# EAGLE design wheel (EAGLE 9.2.2)

## Sheet 1 of 2
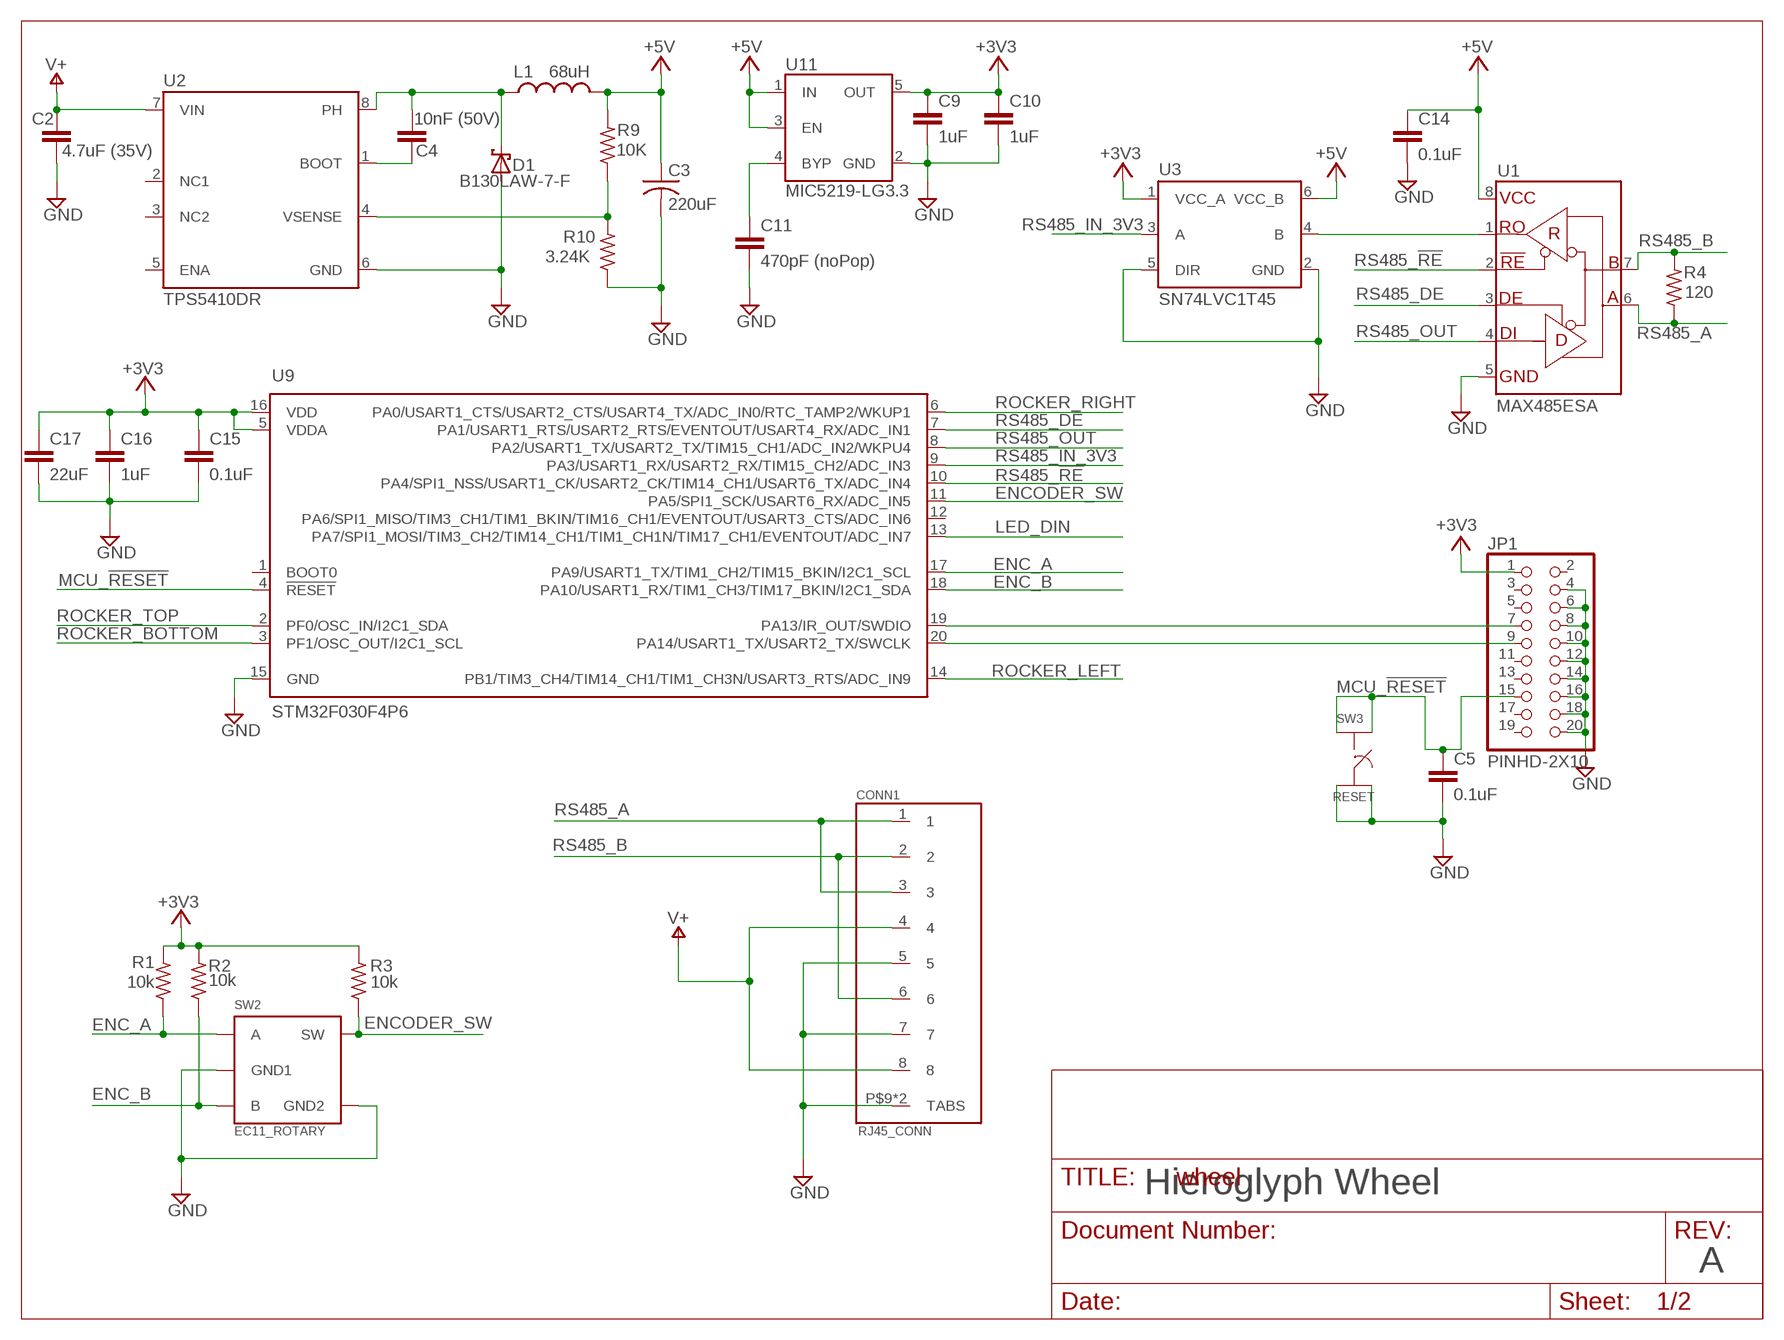
[diagram p0: schematic, sheet 1]

### Parts
C2  4.7uF (35V)  C-EUC0805  [C0805]
C3  220uF  TANT_CAP_D  [KEMET_D_CAP]
C4  10nF (50V)  C-EUC0805  [C0805]
C5  0.1uF  C-EUC0805  [C0805]
C9  1uF  C-EUC0805  [C0805]
C10  1uF  C-EUC0805  [C0805]
C11  470pF (noPop)  C-EUC0805  [C0805]
C14  0.1uF  C-EUC0805  [C0805]
C15  0.1uF  C-EUC0805  [C0805]
C16  1uF  C-EUC0805  [C0805]
C17  22uF  C-EUC0805  [C0805]
CONN1  RJ45_CONN  [RJ45_VERT]
D1  B130LAW-7-F  [SOD123]
JP1  PINHD-2X10  [2X10_W_KEY]
L1  68uH  L_CDRH127  [CDRH127R]
R1  10k  R-US_R0805  [R0805]
R2  10k  R-US_R0805  [R0805]
R3  10k  R-US_R0805  [R0805]
R4  120  R-US_R0805  [R0805]
R9  10K  R-US_R0805  [R0805]
R10  3.24K  R-US_R0805  [R0805]
SW2  EC11_ROTARY  [EC11_ROTARY]
SW3  RESET  MOM_SWITCH  [MOM_SWITCH]
U1  MAX485ESA  [SO08]
U2  TPS5410DR  [SO08]
U3  SN74LVC1T45  [SOT23-6]
U9  STM32F030F4P6  [TSSOP20]
U11  MIC5219-LG3.3  MIC5219XX  [SOT23-5]

### Nets
+3V3: C9.1 C10.1 C15.1 C16.1 C17.1 JP1.1 R1.2 R2.2 R3.2 U3.1(VCC_A) U9.5(VDDA) U9.16(VDD) U11.5(OUT) ; also sheet 2
+5V: C3.+ C14.1 L1.P$2 R9.2 U1.8(VCC) U3.6(VCC_B) U11.1(IN) U11.3(EN) ; also sheet 2
ENC_A: R1.1 SW2.A U9.17(PA9/USART1_TX/TIM1_CH2/TIM15_BKIN/I2C1_SCL)
ENC_B: R2.1 SW2.B U9.18(PA10/USART1_RX/TIM1_CH3/TIM17_BKIN/I2C1_SDA)
ENCODER_SW: R3.1 SW2.SW U9.11(PA5/SPI1_SCK/USART6_RX/ADC_IN5)
GND: C2.2 C3.- C5.2 C9.2 C10.2 C11.2 C14.2 C15.2 C16.2 C17.2 CONN1.5 CONN1.7 CONN1.P$9(TABS) CONN1.P$10(TABS) D1.A JP1.4 JP1.6 JP1.8 JP1.10 JP1.12 JP1.14 JP1.16 JP1.18 JP1.20 R10.1 SW2.C(GND1) SW2.D(GND2) SW3.P$3 SW3.P$4 U1.5(GND) U2.6(GND) U3.2(GND) U3.5(DIR) U9.15(GND) U11.2(GND) ; also sheet 2
LED_DIN: U9.13(PA7/SPI1_MOSI/TIM3_CH2/TIM14_CH1/TIM1_CH1N/TIM17_CH1/EVENTOUT/ADC_IN7) ; also sheet 2
MCU_!RESET: C5.1 JP1.15 SW3.P$1 SW3.P$2 U9.4(!RESET)
N$1: C11.1 U11.4(BYP)
N$2: R9.1 R10.2 U2.4(VSENSE)
N$3: C4.1 D1.C L1.1 U2.8(PH)
N$4: C4.2 U2.1(BOOT)
N$10: JP1.7 U9.19(PA13/IR_OUT/SWDIO)
N$11: JP1.9 U9.20(PA14/USART1_TX/USART2_TX/SWCLK)
N$16: U1.1(RO) U3.4(B)
ROCKER_BOTTOM: U9.3(PF1/OSC_OUT/I2C1_SCL) ; also sheet 2
ROCKER_LEFT: U9.14(PB1/TIM3_CH4/TIM14_CH1/TIM1_CH3N/USART3_RTS/ADC_IN9) ; also sheet 2
ROCKER_RIGHT: U9.6(PA0/USART1_CTS/USART2_CTS/USART4_TX/ADC_IN0/RTC_TAMP2/WKUP1) ; also sheet 2
ROCKER_TOP: U9.2(PF0/OSC_IN/I2C1_SDA) ; also sheet 2
RS485_!RE: U1.2(!RE) U9.10(PA4/SPI1_NSS/USART1_CK/USART2_CK/TIM14_CH1/USART6_TX/ADC_IN4)
RS485_A: CONN1.1 CONN1.3 R4.1 U1.6(A)
RS485_B: CONN1.2 CONN1.6 R4.2 U1.7(B)
RS485_DE: U1.3(DE) U9.7(PA1/USART1_RTS/USART2_RTS/EVENTOUT/USART4_RX/ADC_IN1)
RS485_IN_3V3: U3.3(A) U9.9(PA3/USART1_RX/USART2_RX/TIM15_CH2/ADC_IN3)
RS485_OUT: U1.4(DI) U9.8(PA2/USART1_TX/USART2_TX/TIM15_CH1/ADC_IN2/WKPU4)
V+: C2.1 CONN1.4 CONN1.8 U2.7(VIN)
Unconnected: JP1.2 JP1.3 JP1.5 JP1.11 JP1.13 JP1.17 JP1.19 U2.2(NC1) U2.3(NC2) U2.5(ENA) U9.1(BOOT0) U9.12(PA6/SPI1_MISO/TIM3_CH1/TIM1_BKIN/TIM16_CH1/EVENTOUT/USART3_CTS/ADC_IN6)

### Notes on the sheet
- Hieroglyph Wheel
- A

## Sheet 2 of 2
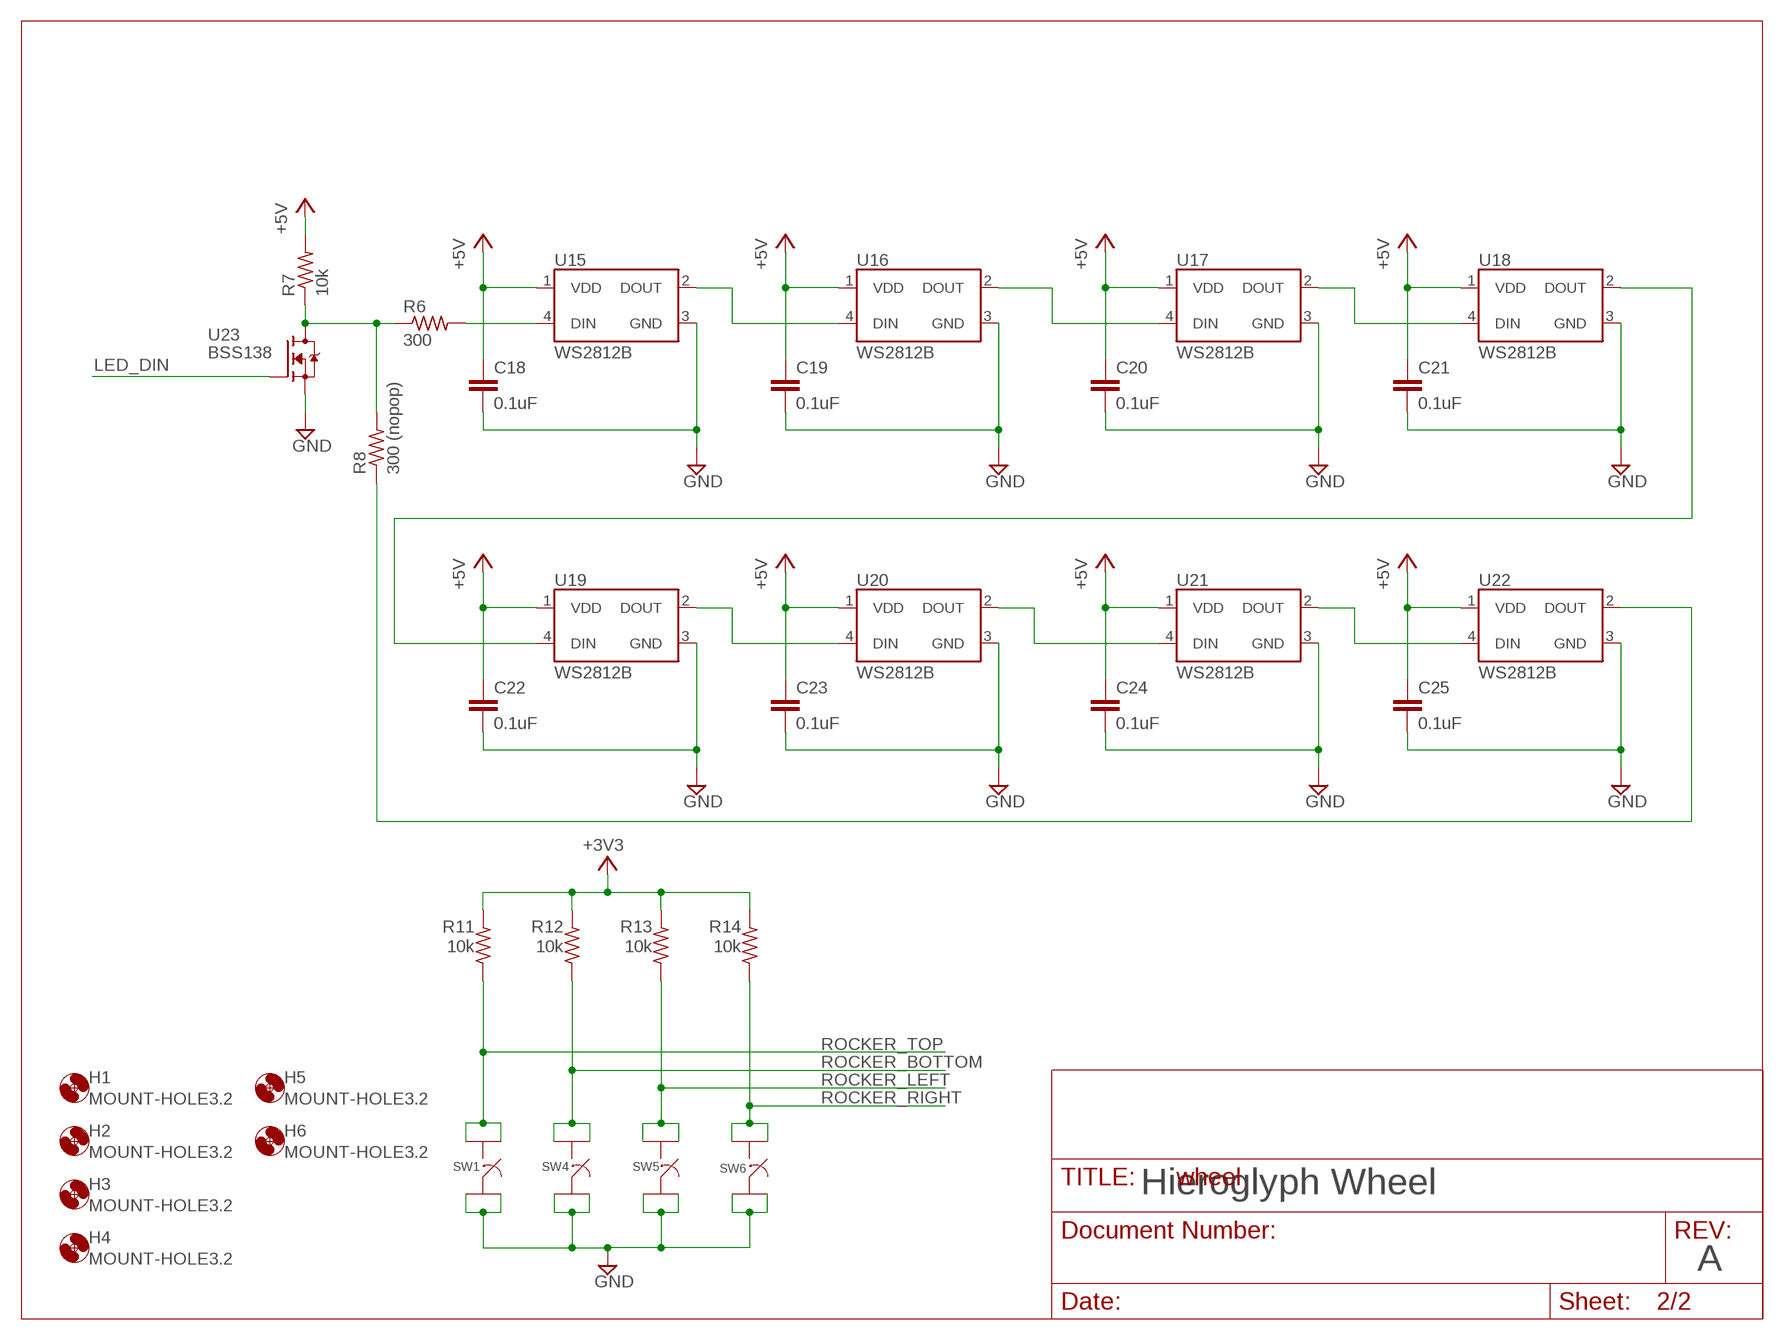
[diagram p1: schematic, sheet 2]

### Parts
C18  0.1uF  C-EUC0805  [C0805]
C19  0.1uF  C-EUC0805  [C0805]
C20  0.1uF  C-EUC0805  [C0805]
C21  0.1uF  C-EUC0805  [C0805]
C22  0.1uF  C-EUC0805  [C0805]
C23  0.1uF  C-EUC0805  [C0805]
C24  0.1uF  C-EUC0805  [C0805]
C25  0.1uF  C-EUC0805  [C0805]
H1  MOUNT-HOLE3.2  [3,2]
H2  MOUNT-HOLE3.2  [3,2]
H3  MOUNT-HOLE3.2  [3,2]
H4  MOUNT-HOLE3.2  [3,2]
H5  MOUNT-HOLE3.2  [3,2]
H6  MOUNT-HOLE3.2  [3,2]
R6  300  R-US_R0805  [R0805]
R7  10k  R-US_R0805  [R0805]
R8  300 (nopop)  R-US_R0805  [R0805]
R11  10k  R-US_R0805  [R0805]
R12  10k  R-US_R0805  [R0805]
R13  10k  R-US_R0805  [R0805]
R14  10k  R-US_R0805  [R0805]
SW1  MOM_SWITCH  [MOM_SWITCH]
SW4  MOM_SWITCH  [MOM_SWITCH]
SW5  MOM_SWITCH  [MOM_SWITCH]
SW6  MOM_SWITCH  [MOM_SWITCH]
U15  WS2812B  [WS2812B]
U16  WS2812B  [WS2812B]
U17  WS2812B  [WS2812B]
U18  WS2812B  [WS2812B]
U19  WS2812B  [WS2812B]
U20  WS2812B  [WS2812B]
U21  WS2812B  [WS2812B]
U22  WS2812B  [WS2812B]
U23  BSS138  [SOT23]

### Nets
+3V3: R11.2 R12.2 R13.2 R14.2 ; also sheet 1
+5V: C18.1 C19.1 C20.1 C21.1 C22.1 C23.1 C24.1 C25.1 R7.2 U15.1(VDD) U16.1(VDD) U17.1(VDD) U18.1(VDD) U19.1(VDD) U20.1(VDD) U21.1(VDD) U22.1(VDD) ; also sheet 1
GND: C18.2 C19.2 C20.2 C21.2 C22.2 C23.2 C24.2 C25.2 SW1.P$3 SW1.P$4 SW4.P$3 SW4.P$4 SW5.P$3 SW5.P$4 SW6.P$3 SW6.P$4 U15.3(GND) U16.3(GND) U17.3(GND) U18.3(GND) U19.3(GND) U20.3(GND) U21.3(GND) U22.3(GND) U23.2(S) ; also sheet 1
LED_DIN: U23.1(G) ; also sheet 1
N$17: U15.2(DOUT) U16.4(DIN)
N$20: U16.2(DOUT) U17.4(DIN)
N$21: U17.2(DOUT) U18.4(DIN)
N$22: U19.2(DOUT) U20.4(DIN)
N$23: U20.2(DOUT) U21.4(DIN)
N$24: U21.2(DOUT) U22.4(DIN)
N$25: U18.2(DOUT) U19.4(DIN)
N$26: R6.2 U15.4(DIN)
N$27: R6.1 R7.1 R8.2 U23.3(D)
N$28: R8.1 U22.2(DOUT)
ROCKER_BOTTOM: R12.1 SW4.P$1 SW4.P$2 ; also sheet 1
ROCKER_LEFT: R13.1 SW5.P$1 SW5.P$2 ; also sheet 1
ROCKER_RIGHT: R14.1 SW6.P$1 SW6.P$2 ; also sheet 1
ROCKER_TOP: R11.1 SW1.P$1 SW1.P$2 ; also sheet 1

### Notes on the sheet
- Hieroglyph Wheel
- A

## Library data of the parts
C2 C4 C5 C9-C11 C14-C25 = rcl:C-EU: CAPACITOR, European symbol; SPICEPREFIX: C
C3 = DougsLab:TANT_CAP_D
CONN1 = DougsLab:RJ45_CONN
D1 = DougsLab:B130LAW-7-F
H1-H6 = holes:MOUNT-HOLE: MOUNTING HOLE with drill center marker
JP1 = DougsLab:PINHD-2X10: PIN HEADER
L1 = DougsLab:L_CDRH127
R1-R4 R6-R14 = rcl:R-US_: RESISTOR, American symbol; SPICEPREFIX: R
SW1 SW3-SW6 = DougsLab:MOM_SWITCH
SW2 = DougsLab:EC11_ROTARY
U1 = DougsLab:MAX485ESA
U2 = DougsLab:TPS5410DR
U3 = DougsLab:SN74LVC1T45
U9 = DougsLab:STM32F030F4P6
U11 = DougsLab:MIC5219XX: http://ww1.microchip.com/downloads/en/DeviceDoc/MIC5219-500mA-Peak-Output-LDO-Regulator-DS20006021A.pdf; OC_FARNELL: unknown; OC_NEWARK: unknown
U15-U22 = DougsLab:WS2812B
U23 = DougsLab:BSS138

## Board
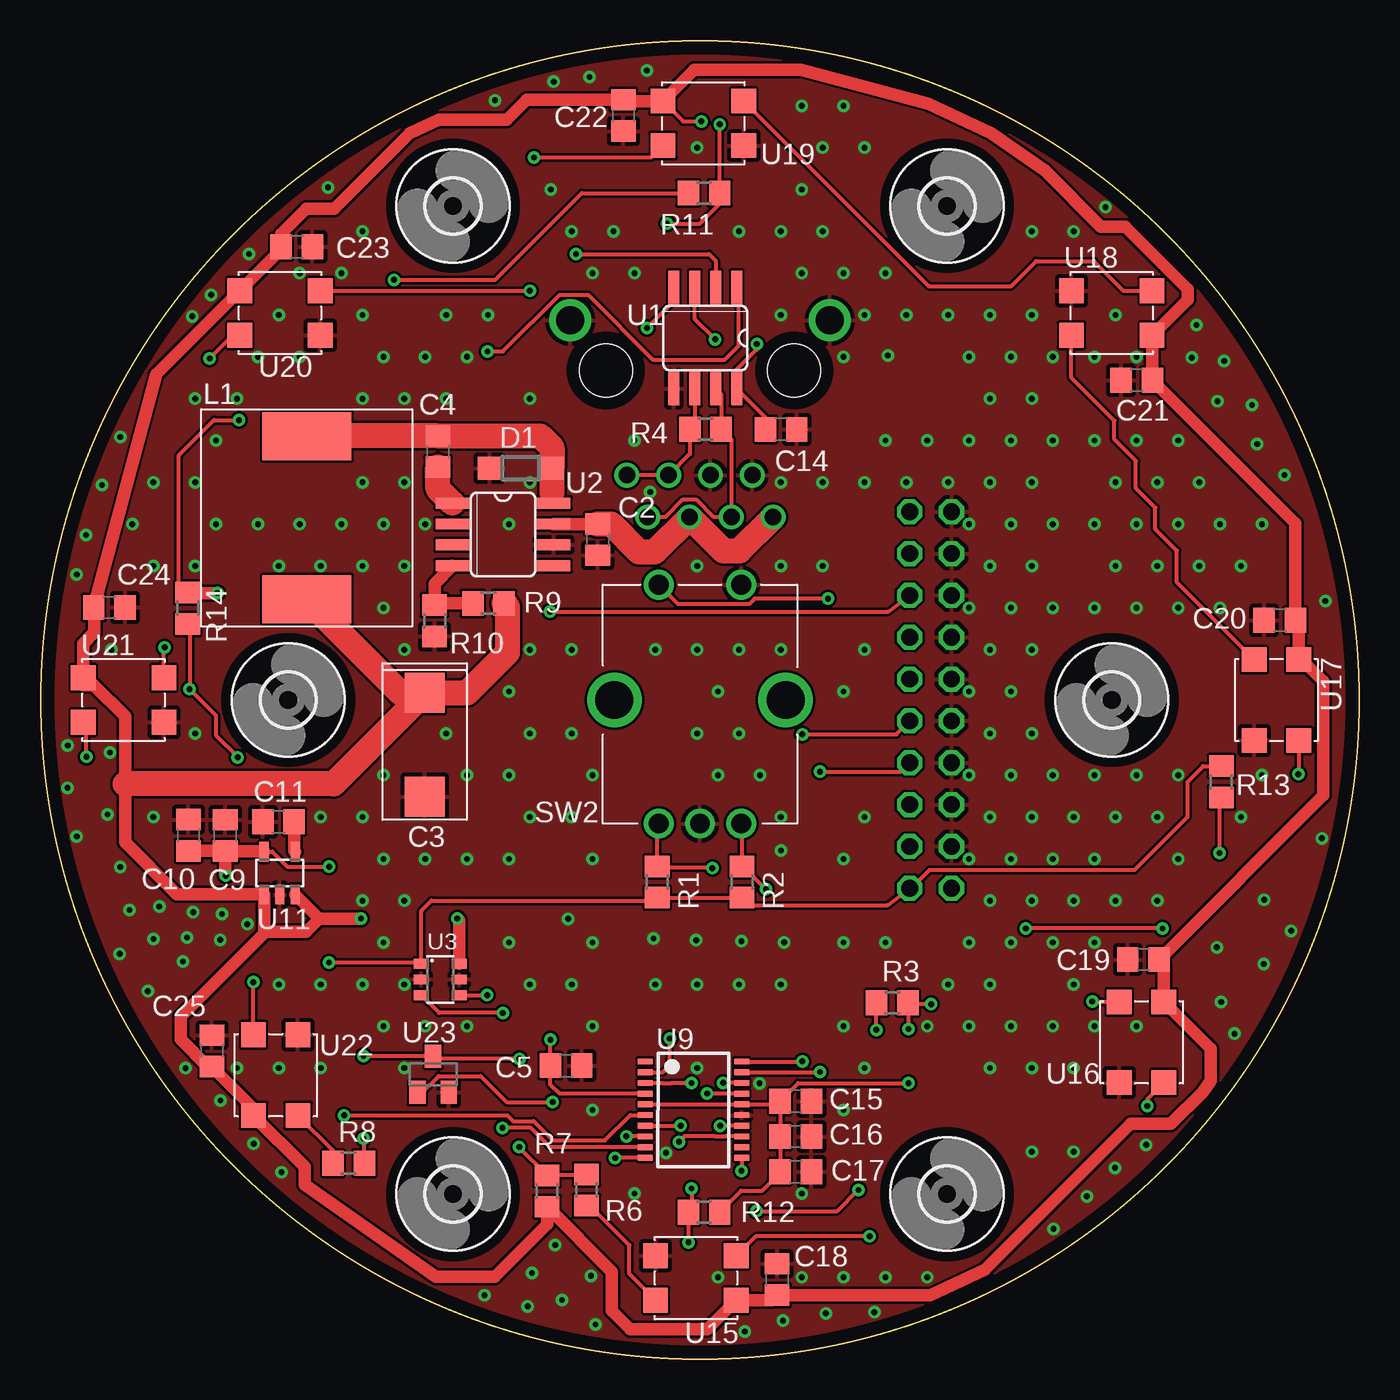
[diagram p2: board, top side]
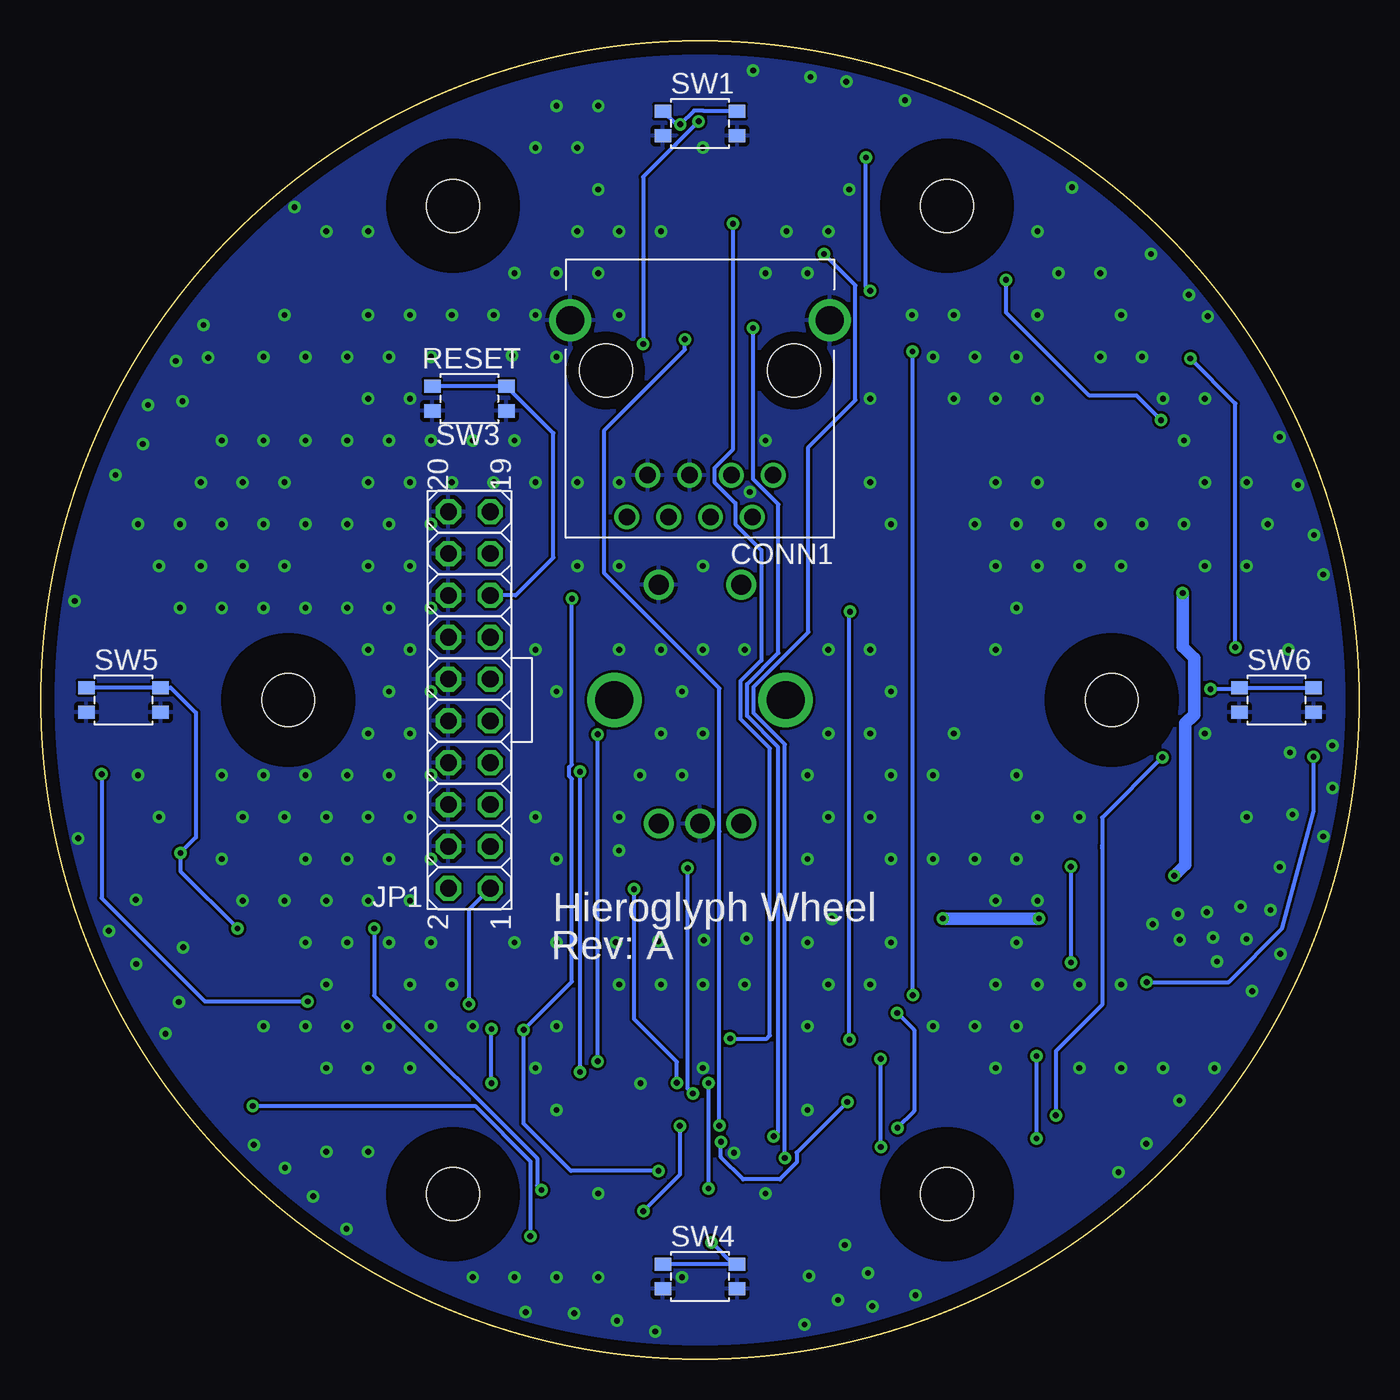
[diagram p3: board, bottom side, seen from below]

Size 80 x 80 mm. Coordinates in mm from the lower left corner, seen from the top.
Outline: circle at 40,40 radius 40
Copper layers (1*16): Top 0.035mm / dielectric 1.5mm / Bottom 0.035mm
Design rules "default *": minimum track width 6mil, minimum drill 0.35mm, track to track 6mil, track to pad 6mil, pad to pad 6mil, via to via 6mil, smd to smd 6mil, copper to edge 30mil, drill to drill 6mil, minimum pad ring 10mil, minimum via ring 8mil, stop-mask expansion 4mil, vias tented up to drill 0mil, thermal gap 10mil

### Footprints (pad centres in the part's own frame; a part is rotated, then mirrored left to right if it is on the bottom)
C0805 = smd 1.3 x 1.5: 1 -0.95,0; 2 0.95,0
KEMET_D_CAP = smd 2.43 x 2.43: + 3.15,0; - -3.15,0
RJ45_VERT = drill 1: 1 -4.445,6.35; 2 -3.175,8.89; 3 -1.905,6.35; 4 -0.635,8.89; 5 0.635,6.35; 6 1.905,8.89; 7 3.175,6.35; 8 4.445,8.89 | drill 1.7 pad 1.93: P$9 -7.875,-3.05; P$10 7.875,-3.05 | hole 3.2: -5.715,0; 5.715,0
SOD123 = smd 1.4 x 1.4: A 1.9,0; C -1.9,0
3,2 = hole 3.2: 0,0
2X10_W_KEY = drill 1.016 octagon: 1 -11.43,-1.27; 2 -11.43,1.27; 3 -8.89,-1.27; 4 -8.89,1.27; 5 -6.35,-1.27; 6 -6.35,1.27; 7 -3.81,-1.27; 8 -3.81,1.27; 9 -1.27,-1.27; 10 -1.27,1.27; 11 1.27,-1.27; 12 1.27,1.27; 13 3.81,-1.27; 14 3.81,1.27; 15 6.35,-1.27; 16 6.35,1.27; 17 8.89,-1.27; 18 8.89,1.27; 19 11.43,-1.27; 20 11.43,1.27
CDRH127R = smd 5.4 x 2.9: 1 0,4.95; P$2 0,-4.95
R0805 = smd 1.3 x 1.5: 1 -0.95,0; 2 0.95,0
MOM_SWITCH = smd 1 x 0.8: P$1 -2.25,0.75; P$2 2.25,0.75; P$3 -2.25,-0.75; P$4 2.25,-0.75
EC11_ROTARY = drill 1.2: A -2.5,-7.5; B 2.5,-7.5; C 0,-7.5; D 2.5,7; SW -2.5,7 | drill 2.3: P$6 -5.2,0; P$7 5.2,0
SO08 = smd 0.66 x 2.032: 1 -1.905,-3.073; 2 -0.635,-3.073; 3 0.635,-3.073; 4 1.905,-3.073; 5 1.905,3.073; 6 0.635,3.073; 7 -0.635,3.073; 8 -1.905,3.073
SOT23-6 = smd 0.6 x 0.9: 1 -0.95,-1.15; 2 0,-1.15; 3 0.95,-1.15; 4 0.95,1.15; 5 0,1.15; 6 -0.95,1.15
TSSOP20 = smd 0.9 x 0.35: 1 -2.925,4.49; 2 -2.925,3.84; 3 -2.925,3.19; 4 -2.925,2.54; 5 -2.925,1.89; 6 -2.925,1.24; 7 -2.925,0.59; 8 -2.922,-0.059; 9 -2.922,-0.709; 10 -2.922,-1.359; 11 2.928,-1.359; 12 2.928,-0.709; 13 2.928,-0.059; 14 2.925,0.59; 15 2.925,1.24; 16 2.925,1.89; 17 2.925,2.54; 18 2.925,3.19; 19 2.925,3.84; 20 2.925,4.49
SOT23-5 = smd 0.55 x 1.2: 1 -0.95,-1.3; 2 0,-1.3; 3 0.95,-1.3; 4 0.95,1.3; 5 -0.95,1.3
WS2812B = smd 1.5 x 1.5: 1 -2.45,1.35; 2 -2.45,-1.35; 3 2.45,-1.35; 4 2.45,1.35
SOT23 = smd 1 x 1.4: 1 -0.95,-1.1; 2 0.95,-1.1; 3 0,1.1

### Placement (x,y rotation side)
C2  33.79,49.74 270 top
C3  23.27,37.28 90 top
C4  24.09,55.08 270 top
C5  31.87,17.8 0 top
C9  11.18,31.78 90 top
C10  8.94,31.79 90 top
C11  14.41,32.61 180 top
C14  44.92,56.43 0 top
C15  45.81,15.63 0 top
C16  45.81,13.5 0 top
C17  45.81,11.36 0 top
C18  44.68,4.82 90 top
C19  66.92,24.24 180 top
C20  75.2,44.84 180 top
C21  66.51,59.41 180 top
C22  35.35,75.49 270 top
C23  15.52,67.51 0 top
C24  4.14,45.62 0 top
C25  10.37,18.7 90 top
CONN1  40,60 180 bottom
D1  29.12,54.08 180 top
H1  55,70 0 top
H2  55,10 0 top
H3  25,70 0 top
H4  25,10 0 top
H5  65,40 0 top
H6  15,40 0 top
JP1  54,40 90 bottom
L1  16.13,51.06 0 top
R1  37.41,28.95 270 top
R2  42.56,28.95 270 top
R3  51.67,21.62 0 top
R4  40.34,56.43 0 top
R6  33.11,10.25 270 top
R7  30.71,10.19 270 top
R8  18.67,11.88 0 top
R9  27.16,45.86 0 top
R10  23.89,44.81 90 top
R11  40.25,70.78 180 top
R12  40.25,8.9 0 top
R13  71.66,35.03 90 top
R14  8.9,45.57 90 top
SW1  40,75 0 bottom
SW2  40,40 0 top
SW3  54,58.3 0 bottom
SW4  40,5 0 bottom
SW5  75,40 0 bottom
SW6  5,40 0 bottom
U1  40.32,61.98 180 top
U2  28.04,50.05 270 top
U3  24.23,23.03 270 top
U9  39.6,13.56 0 top
U11  14.48,29.49 0 top
U15  39.76,4.9 180 top
U16  66.81,19.22 270 top
U17  75,40 270 top
U18  65,63.5 180 top
U19  40.2,75.01 0 top
U20  14.5,63.5 0 top
U21  5,40 0 top
U22  14.24,17.22 90 top
U23  23.8,17.28 0 top

### Tracks (layer width: path | path; a pad name or v marks a point on that pad's centre or on a via)
+3V3  (via drill 0.35)
  Top 0.254: U9.5 U9.16 44.67,15.45 C15.1 | C15.1 C16.1 C17.1 44.86,11.28 43.78,10.21 42.5,10.21 R12.2 | U11.5 14.04,30.79 14.95,29.88 v17.48,29.88 | v17.48,24.06 23,24.06 U3.1 23.08,27.2 23.69,27.82 37.22,27.82 R1.2 R2.2 43.01,27.55 51.38,27.55 JP1.1 52.83,28.57 53.93,29.67 66.37,29.67 69.58,32.88 69.58,35.02 70.55,35.98 R13.2 | 52.66,21.58 52.71,21.54 v54.04,21.54 | v21.42,65.51 27.56,65.51 32.83,70.78 R11.2 | C15.1 45.96,16.74 v52.66,16.74 | v52.66,20.02 52.66,21.58 | R3.2 52.66,21.58 | R14.2 8.36,47.07 8.36,54.86 10.5,57.01 10.51,56.99 v12.01,56.99
  Top 0.762: C10.1 11.17,30.84 C9.1 | C9.1 13.49,30.83 U11.5 | C9.1 11.18,29.36 v11.21,29.33 | v10.7,46.5 8.93,46.5 R14.2
  Bottom 0.254: v17.48,29.88 v17.48,24.07 v17.48,24.06 | v12.01,56.99 13.49,58.47 16.36,58.47 21.42,63.52 v21.42,65.51 | v52.66,16.74 v52.66,20.02 | JP1.1 54.04,27.26 v54.04,21.54
  Bottom 0.762: v11.21,29.33 10.54,30 10.54,38.57 10,39.12 10,42.55 10.68,43.23 10.68,46.48 v10.7,46.5
+5V  (via drill 0.35)
  Top 0.254: C14.1 43.98,57.16 U1.8 42.23,60.07 43.45,61.29 v43.45,61.61 | U19.1 38.98,75.13 v40.08,75.13
  Top 0.762: 13.53,25.84 8.46,20.77 8.46,19.4 10.11,17.75 C25.1 12.89,15.22 U22.1 16,11.66 16,10.56 23.95,5 27.53,5 30.71,8.18 R7.2 34.65,5.3 34.65,2.93 35.78,1.8 40.45,1.8 U15.1 44.37,3.55 C18.1 53.99,3.87 57.29,5.41 66.14,14.26 68.59,14.26 70.52,16.18 71.01,16.89 71.01,18.82 U16.1 68.16,23.95 C19.1 77.85,34.22 77.85,41.14 76.54,42.45 U17.1 76.35,44.65 C20.1 76.15,50.73 C21.1 67.46,62.14 U18.1 69.61,64.31 69.61,64.94 65.81,68.75 64.33,68.75 60.96,72.12 57.7,74.4 53.84,76.2 46.11,78.27 39.66,78.27 U19.1 35.59,76.36 C22.1 29.47,76.44 28.25,75.23 24.13,75.23 22.39,74.42 17.8,69.83 16.11,69.83 14.57,68.3 C23.1 14.57,67.37 U20.1 6.99,59.79 C24.1 3.23,45.58 3.23,44.1 2.55,43.43 U21.1 2.55,40.9 3.2,40.9 5.1,39 5.1,34.91 5.1,31.35 8.24,28.2 13.52,28.2 U11.1 13.53,25.84 | U11.3 16.89,26.73 | 16.89,26.73 v19.42,26.73 | v25.26,26.73 25.38,26.61 U3.6 | 13.53,25.84 13.61,25.92 16.08,25.92 16.89,26.73
  Top 1.524: C3.+ 21.8,40.43 L1.P$2 | C3.+ 25.86,40.43 28.32,42.89 28.32,45.65 R9.2 | 5.1,34.91 17.75,34.91 C3.+
  Bottom 0.254: v43.45,61.61 43.45,71.76 41.64,73.57 41.63,73.57 41.47,73.73 41.47,73.74 v40.08,75.13
  Bottom 0.762: v19.42,26.73 v25.26,26.73
ENC_A  (via drill 0.35)
  Top 0.254: U9.17 41.68,16.1 40.45,16.1 v40.43,16.11 | v40.75,29.79 40.73,29.81 37.5,29.81 R1.1 37.41,32.41 SW2.A
  Bottom 0.254: v40.43,16.11 40.75,16.42 v40.75,29.79 | v40.75,29.79
ENC_B  (via drill 0.35)
  Top 0.254: U9.18 v41.41,16.75 | v44,28.52 42.62,29.9 R2.1 42.56,32.44 SW2.B
  Bottom 0.254: v41.41,16.75 41.41,18.03 44,20.63 v44,28.52
ENCODER_SW  (via drill 0.35)
  Top 0.254: U9.11 v42.53,11.42 v42.52,11.41 | v50.7,19.98 50.7,21.6 R3.1 | v47.78,46.15 43.32,46.15 42.99,45.82 38.68,45.82 SW2.SW
  Bottom 0.254: v42.52,11.41 47.84,11.41 50.71,14.28 50.71,19.97 v50.7,19.98 47.78,22.9 47.78,35.21 47.94,35.38 47.94,35.92 47.78,36.08 v47.78,46.15
GND  (via drill 0.35)
  other vias: 4.27,43.05 5.54,50.67 6.81,32.89 6.81,48.13 6.81,53.21 9.35,37.97 9.35,48.13 10.62,50.67 9.35,53.21 10.62,55.75 9.35,58.29 11.89,17.65 13.16,50.67 11.89,58.29 13.16,60.83 14.43,17.65 14.43,22.73 14.43,48.13 15.7,50.67 15.7,60.83 14.43,63.37 15.7,65.91 16.97,17.65 16.97,22.73 16.97,32.89 16.97,48.13 18.24,50.67 18.24,65.91 20.78,20.19 19.51,22.73 20.78,25.27 19.51,27.81 20.78,30.35 19.51,32.89 20.78,35.43 20.78,45.59 19.51,48.13 20.78,50.67 19.51,53.21 19.51,58.29 20.78,60.83 19.51,63.37 19.51,68.45 22.05,17.65 23.32,20.19 22.05,22.73 22.05,27.81 23.32,30.35 22.05,43.05 22.05,48.13 23.32,50.67 22.05,53.21 22.05,58.29 23.32,60.83 25.86,20.19 25.86,30.35 25.86,35.43 24.59,37.97 24.59,58.29 25.86,60.83 24.59,63.37 28.4,25.27 28.4,30.35 28.4,35.43 28.4,40.51 28.4,50.67 27.13,63.37 29.67,22.73 29.67,32.89 29.67,37.97 29.67,43.05 29.67,53.21 29.67,58.29 30.94,70.99 33.48,15.11 33.48,20.19 32.21,22.73 33.48,25.27 33.48,30.35 32.21,32.89 33.48,35.43 32.21,37.97 32.21,43.05 33.48,65.91 32.21,68.45 36.02,10.03 36.02,55.75 36.02,65.91 34.75,68.45 37.29,22.73 37.29,43.05 41.1,4.95 39.83,17.65 39.83,22.73 41.1,35.43 39.83,37.97 41.1,40.51 39.83,43.05 39.83,48.13 39.83,73.53 42.37,22.73 43.64,35.43 42.37,37.97 42.37,43.05 42.37,68.45 46.18,4.95 46.18,10.03 44.91,22.73 44.91,32.89 44.91,43.05 44.91,48.13 44.91,53.21 44.91,63.37 46.18,65.91 44.91,68.45 46.18,70.99 46.18,76.07 48.72,4.95 48.72,15.11 48.72,20.19 48.72,25.27 48.72,30.35 48.72,40.51 47.45,48.13 47.45,53.21 48.72,60.83 48.72,65.91 47.45,68.45 47.45,73.53 48.72,76.07 51.26,4.95 49.99,17.65 51.26,25.27 49.99,32.89 49.99,43.05 49.99,53.21 51.26,55.75 49.99,63.37 51.26,65.91 49.99,73.53 53.8,4.95 53.8,20.19 52.53,53.21 53.8,55.75 51.4,60.91 52.53,63.37 56.34,20.19 55.07,22.73 56.34,25.27 56.34,30.35 56.34,35.43 56.34,40.51 56.34,45.59 56.34,50.67 55.07,53.21 56.34,55.75 56.34,60.83 55.07,63.37 57.61,17.65 58.88,20.19 57.61,22.73 58.88,25.27 57.61,27.81 58.88,30.35 57.61,32.89 58.88,35.43 57.61,37.97 58.88,40.51 57.61,43.05 58.88,45.59 57.61,48.13 58.88,50.67 57.61,53.21 58.88,55.75 57.61,58.29 58.88,60.83 57.61,63.37 60.15,12.57 60.15,17.65 61.42,20.19 61.42,25.27 60.15,27.81 61.42,30.35 60.15,32.89 61.42,35.43 60.15,37.97 60.15,43.05 61.42,45.59 60.15,48.13 61.42,50.67 60.15,53.21 61.42,55.75 60.15,58.29 61.42,60.83 60.15,63.37 60.15,68.45 62.69,12.57 62.69,17.65 63.96,20.19 62.69,22.73 63.96,25.27 62.69,27.81 63.96,30.35 62.69,32.89 63.96,35.43 63.96,45.59 63.96,50.67 63.96,55.75 63.96,60.83 62.69,68.45 66.5,20.19 65.23,27.81 65.23,32.89 66.5,35.43 66.5,45.59 65.23,48.13 66.5,50.67 65.23,53.21 66.5,55.75 66.5,60.83 65.23,63.37 67.77,27.81 69.04,30.35 67.77,32.89 69.04,35.43 69.04,45.59 67.77,48.13 69.04,50.67 67.77,53.21 69.04,55.75 71.58,45.59 70.31,48.13 71.58,50.67 70.31,53.21 72.85,32.89 74.12,35.43 72.85,48.13 74.12,50.67 37.93,12.51 36.97,52.63 70.14,62.76 69.86,60.78 71.83,60.58 73.83,55.54 71.42,58.14 73.52,57.91 75.49,53.66 36.77,78.22 33.29,77.83 27.56,76.41 31.12,77.54 17.41,71.13 12.61,67.07 10.32,64.6 9.17,63.3 4.81,55.97 3.7,53.06 2.72,50.01 2.15,47.62 1.61,37.24 4.18,36.81 4.03,33.04 2.15,31.71 1.59,34.67 4.8,29.87 5.37,27.25 7.18,27.47 6.83,25.5 9.23,27.11 10.98,27.01 12.52,26.39 10.87,25.44 8.85,25.58 8.61,24.12 4.77,24.59 6.47,22.32 8.77,17.65 10.88,15.69 12.9,13.06 14.59,11.33 26.92,3.86 31.21,6.91 29.8,5.21 33.38,5.04 31.62,3.58 29.54,3.18 33.66,2.08 42.72,1.66 45.03,2.32 47.64,2.76 50.59,2.83 61.47,7.89 63.49,9.87 65.2,11.6 67.09,12.99 72.45,19.74 71.64,21.67 74.23,23.97 75.89,25.99 71.38,24.98 74.25,27.87 77.75,31.6 77.97,46 37.17,25.52 39.76,25.42 42.52,25.35 45.11,25.29 44.91,30.86 31.99,26.71 43.62,16.73 64.62,69.92
  pour Top: 0,55.88 -0.76,55.12 -0.76,30.73 -0.76,21.08 18.29,2.03 21.84,-1.52 56.13,-1.52 81.53,23.88 81.53,55.12 81.53,58.67 81.79,58.93 58.93,81.79 20.83,81.79 0,60.96
  pour Bottom: -0.51,52.58 -0.51,59.44 17.27,77.22 20.83,80.77 56.9,80.77 78.49,59.18 81.03,56.64 81.53,56.64 81.53,19.05 59.94,-2.54 23.62,-2.54 1.27,19.81 0,21.08 -0.51,21.59
LED_DIN  (via drill 0.35)
  Top 0.254: v38.73,13.18 39.05,13.5 40.94,13.5 40.95,13.49 41.49,13.49 41.51,13.5 U9.13 | U23.1 23.15,16.18 24.13,17.16 26.68,17.16 28.26,15.59 v31.05,15.59
  Bottom 0.254: v31.05,15.59 34.13,12.51 34.13,11.92 35.15,10.9 37.37,10.9 38.73,12.25 v38.73,13.18
MCU_!RESET  (via drill 0.35)
  Top 0.254: U9.4 31.47,16.1 30.92,16.65 C5.1 v30.92,19.38 | v30.89,45.36 51.42,45.36 JP1.15
  Bottom 0.254: v30.92,19.38 30.92,45.33 v30.89,45.36 | SW3.P$1 SW3.P$2 48.9,56.2 48.9,48.65 51.2,46.35 JP1.15
N$1
  Top 0.762: C11.1 15.36,30.86 U11.4
N$2
  Top 0.762: R9.1 23.99,45.86 R10.2 23.89,47.06 U2.4
N$3
  Top 0.254: U2.8 31.02,52.05 31.02,52.58
  Top 1.524: L1.1 16.15,56.03 C4.1 30.3,56.03 31.02,55.31 D1.C 31.02,52.58
N$4
  Top 1.524: U2.1 24.09,52.84 C4.2
N$10  (via drill 0.35)
  Top 0.254: U9.19 v47.28,17.4 v47.28,17.41 | v47.28,35.65 52.19,35.65 JP1.7
  Bottom 0.254: v47.28,17.41 v47.28,35.65
N$11  (via drill 0.35)
  Top 0.254: U9.20 46.2,18.05 v46.22,18.06 | v46.21,37.92 51.92,37.92 JP1.9
  Bottom 0.254: v46.22,18.06 v46.22,37.91 v46.21,37.92
N$16  (via drill 0.35)
  Top 0.254: U3.4 v27.07,22.08 | v27.09,61.16 28.04,61.16 31.48,64.6 33.2,64.6 37.13,60.67 41.51,60.67 42.35,61.51 42.35,64.93 U1.1
  Bottom 0.254: v27.07,22.08 27.07,61.15 v27.09,61.16
N$17  (via drill 0.35)
  Top 0.254: U16.4 67.16,15.77 v67.16,15.35 | v50.3,7.44 43.4,7.44 U15.2
  Bottom 0.254: v67.16,15.35 53.66,15.35 50.3,11.99 v50.3,7.44
N$20  (via drill 0.35)
  Top 0.254: U17.4 76.35,35.52 v76.33,35.5 | v63.82,21.69 65.44,21.69 U16.2
  Bottom 0.254: v76.33,35.5 76.33,27.97 70.06,21.7 v63.83,21.7 v63.82,21.69
N$21
  Top 0.254: U17.2 68.96,47.14 68.96,49.07 67.65,50.37 67.65,51.68 66.47,52.87 66.47,54.51 65.16,55.82 65.16,56.97 62.55,59.58 U18.4
N$22  (via drill 0.35)
  Top 0.254: U20.4 v29.66,64.85 v29.67,64.85 | v29.92,72.94 37.03,72.94 U19.2
  Bottom 0.254: v29.67,64.85 29.92,65.11 v29.92,72.94
N$23  (via drill 0.35)
  Top 0.254: U21.4 7.45,43.15 v7.5,43.2 | v10.23,60.74 11.65,62.15 U20.2
  Bottom 0.254: v7.5,43.2 7.5,58 v10.23,60.74
N$24  (via drill 0.35)
  Top 0.254: U22.4 v12.89,22.86 v12.88,22.87 | v2.75,36.55 2.75,38.45 U21.2
  Bottom 0.254: v12.88,22.87 7.91,22.87 4.65,26.13 2.75,33.23 v2.75,36.55
N$25
  Top 0.254: U18.2 65.71,64.85 63.92,66.64 60.41,66.64 58.89,65.12 53.89,65.12 U19.4
N$26
  Top 0.254: U15.4 35.7,5.15 35.7,6.9 33.3,9.3 R6.2
N$27  (via drill 0.35)
  Top 0.254: v29.02,12.86 29.02,12.83 R7.1 33.05,11.13 R6.1 | v29.03,18.21 23.96,18.21 U23.3 v19.57,18.38 | v19.57,13.38 19.57,11.93 R8.2
  Bottom 0.254: v29.02,12.86 v29.02,18.2 v29.03,18.21 | v19.57,18.38 v19.57,13.38
N$28
  Top 0.254: R8.1 17.72,12.64 U22.2
ROCKER_BOTTOM  (via drill 0.35)
  Top 0.254: v39.48,16.75 38.26,16.75 38.25,16.75 37.71,16.75 37.7,16.75 U9.3 | v39.48,10.34 39.48,9.09 R12.1 v39.3,7.08 v39.3,7.07
  Bottom 0.254: v39.48,16.75 v39.48,10.34 | v39.48,10.34 | v39.3,7.07 37.98,5.75 SW4.P$2 SW4.P$1
ROCKER_LEFT  (via drill 0.35)
  Top 0.254: U9.14 v41.23,14.15 v41.22,14.15 | v43.44,8.96 48.33,8.96 v49.62,10.25 | v71.55,30.72 71.55,33.97 R13.1 | v68.08,26.13 v59.78,26.13
  Bottom 0.254: v41.22,14.15 41.22,11.18 v43.44,8.96 | v49.62,10.25 49.89,10.53 49.89,12.16 59.78,22.05 v59.78,26.13 | v68.08,26.13 71.55,29.6 71.55,29.61 v71.55,30.72 70.61,31.65 70.61,39.23 72.13,40.75 SW5.P$2 SW5.P$1 | v68.08,26.13
ROCKER_RIGHT  (via drill 0.35)
  Top 0.254: v18.4,14.78 28.31,14.78 28.66,14.44 29.9,14.44 31.07,13.26 34.23,13.26 35.77,14.8 U9.6 | R14.1 9.01,44.52 v9.01,40.66 10.6,39.07 10.6,37.87 11.93,36.54 v11.93,36.52
  Bottom 0.254: v9.01,40.66 7.34,40.66 SW6.P$1 SW6.P$2 | v18.4,14.78 18.4,18.68 15.59,21.49 15.59,31.02 15.59,31.16 15.59,32.86 v11.93,36.52
ROCKER_TOP  (via drill 0.35)
  Top 0.254: v38,68.92 39.97,68.92 41.2,70.14 R11.1 v41.2,74.95 | U9.2 37.74,17.4 38.17,17.82 v38.17,19.44
  Bottom 0.254: v38,68.92 37.98,68.9 37.98,55.23 39.13,54.08 39.13,53.22 37.86,51.95 37.86,50.68 36.28,49.1 36.28,42.41 37.55,41.14 37.55,38.86 35.75,37.06 35.75,19.63 35.94,19.44 v38.17,19.44 | SW1.P$2 39.77,75.75 39.81,75.79 40.35,75.79 v41.19,74.95 v41.2,74.95 41.45,74.95 SW1.P$1
RS485_!RE  (via drill 0.35)
  Top 0.254: U9.10 34.86,12.2 v34.85,12.19 | v32.47,67.07 40.56,67.07 40.96,66.68 U1.2
  Bottom 0.254: v34.85,12.19 34.85,37.31 36.74,39.2 36.74,40.8 33.41,44.13 33.41,55.36 30.57,58.2 30.57,65.18 v32.47,67.07
RS485_A
  Top 0.254: U1.6 39.69,56.73 R4.1 39.39,54.94 CONN1.3 CONN1.1
RS485_B
  Top 0.254: U1.7 41.29,58.58 R4.2 41.91,55.81 CONN1.6 40.84,51.11 39.8,52.15 38.93,52.15 37.89,51.11 CONN1.2
RS485_DE  (via drill 0.35)
  Top 0.254: U9.7 38.82,14.15 v38.83,14.16 | v40.92,61.9 39.69,63.13 U1.3
  Bottom 0.254: v38.83,14.16 38.83,32.01 38.82,32.01 38.82,40.7 45.81,47.69 45.81,56.39 40.92,61.28 v40.92,61.9
RS485_IN_3V3  (via drill 0.35)
  Top 0.254: U9.9 30.91,12.85 29.73,14.03 v28.02,14.03 | v28.03,21 24.16,21 U3.3
  Bottom 0.254: v28.02,14.03 27.01,15.04 27.01,19.98 v28.03,21
RS485_OUT  (via drill 0.35)
  Top 0.254: U9.8 v35.54,13.5 v35.53,13.51 | v36.77,62.58 38.42,64.22 U1.4
  Bottom 0.254: v35.53,13.51 35.29,13.75 35.29,37.17 37.14,39.03 37.14,40.97 35.25,42.87 35.25,51.88 36.77,53.41 v36.77,62.58
V+
  Top 0.762: U2.7 C2.1
  Top 1.524: C2.1 34.6,50.69 36.29,49 37.25,49 CONN1.4 41.42,49.06 42.39,49.06 CONN1.8

### Text on the board
bPlace: Hieroglyph Wheel | Rev: A